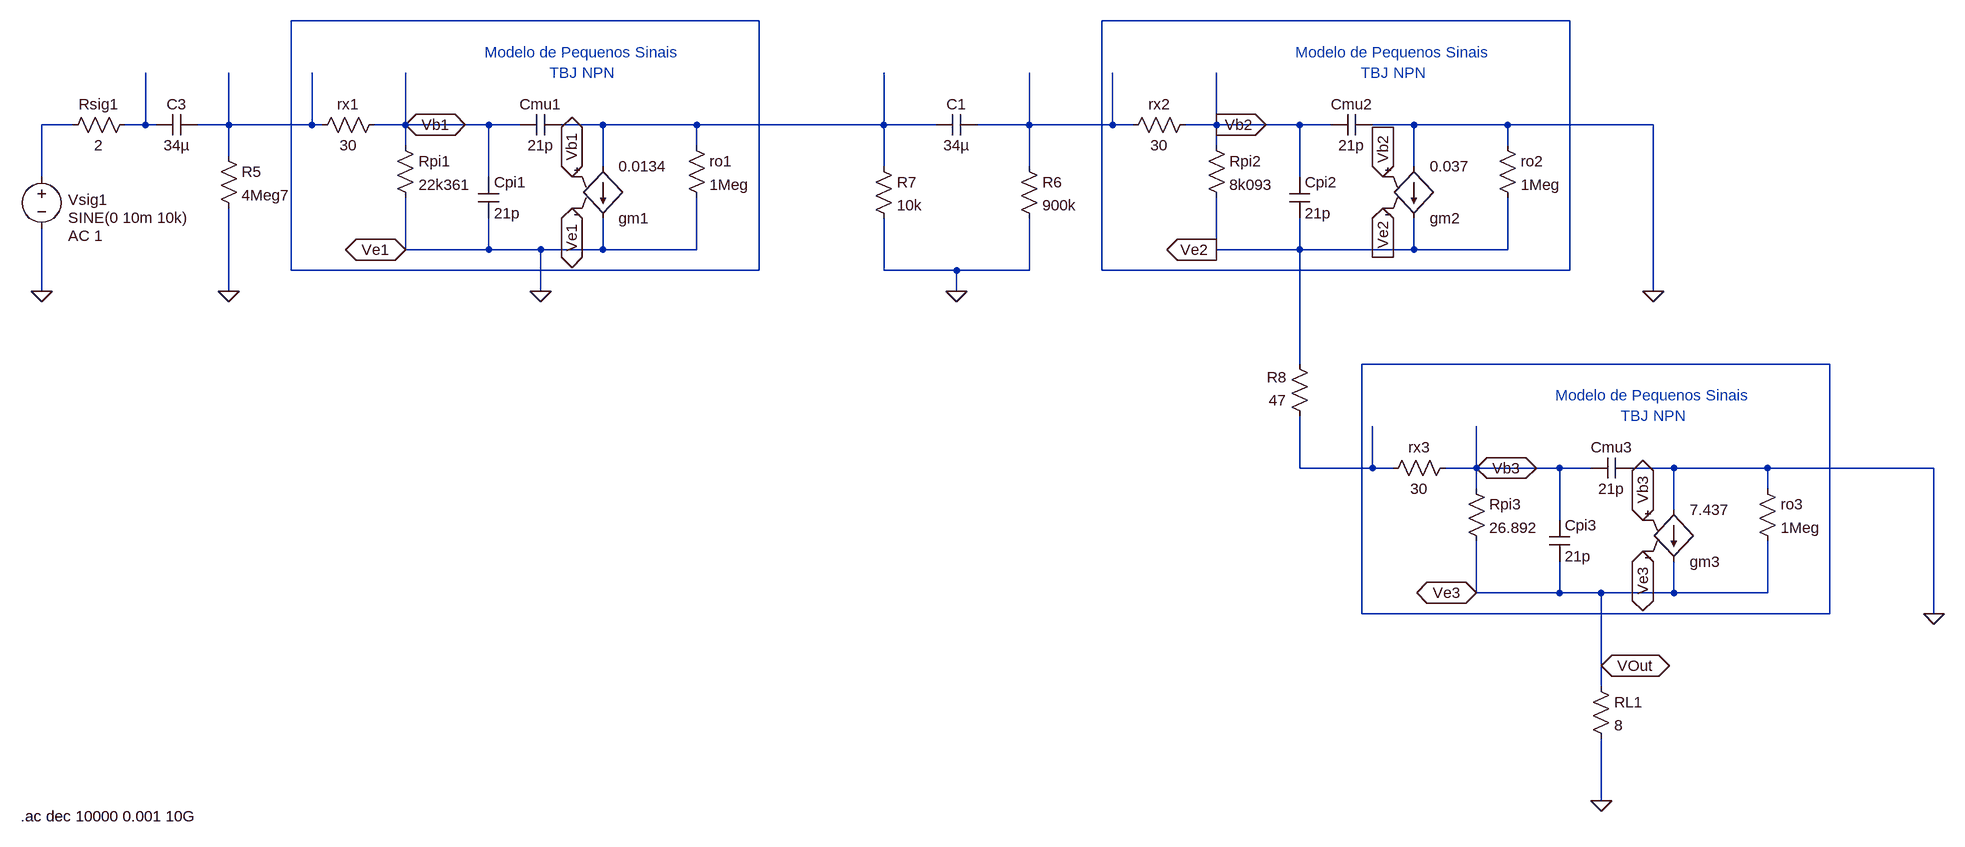
[diagram p0: schematic TBJ - Radio - AM - mod - Resposta em Frequencia.asc]
TBJ - Radio - AM - mod - Resposta em Frequencia.asc, the LTspice schematic file:
Version 4
SHEET 1 3324 2452
WIRE -96 800 -816 800
WIRE 1152 800 432 800
WIRE -1152 960 -1200 960
WIRE -1040 960 -1040 880
WIRE -1040 960 -1072 960
WIRE -1024 960 -1040 960
WIRE -912 960 -912 880
WIRE -912 960 -960 960
WIRE -784 960 -784 880
WIRE -784 960 -912 960
WIRE -768 960 -784 960
WIRE -640 960 -640 880
WIRE -640 960 -688 960
WIRE -512 960 -640 960
WIRE -464 960 -512 960
WIRE -336 960 -400 960
WIRE -192 960 -336 960
WIRE 96 960 96 880
WIRE 96 960 -192 960
WIRE 176 960 96 960
WIRE 320 960 320 880
WIRE 320 960 240 960
WIRE 448 960 448 880
WIRE 448 960 320 960
WIRE 480 960 448 960
WIRE 608 960 608 880
WIRE 608 960 560 960
WIRE 736 960 608 960
WIRE 784 960 736 960
WIRE 912 960 848 960
WIRE 1056 960 912 960
WIRE 1280 960 1056 960
WIRE -640 992 -640 960
WIRE -192 992 -192 960
WIRE 608 992 608 960
WIRE 1056 992 1056 960
WIRE -912 1008 -912 960
WIRE -336 1024 -336 960
WIRE 96 1024 96 960
WIRE 320 1024 320 960
WIRE 912 1024 912 960
WIRE -1200 1040 -1200 960
WIRE -512 1040 -512 960
WIRE 736 1040 736 960
WIRE -640 1152 -640 1072
WIRE -512 1152 -512 1104
WIRE -512 1152 -640 1152
WIRE -432 1152 -512 1152
WIRE -336 1152 -336 1104
WIRE -336 1152 -432 1152
WIRE -192 1152 -192 1072
WIRE -192 1152 -336 1152
WIRE 608 1152 608 1072
WIRE 736 1152 736 1104
WIRE 736 1152 608 1152
WIRE 912 1152 912 1104
WIRE 912 1152 736 1152
WIRE 1056 1152 1056 1072
WIRE 1056 1152 912 1152
WIRE -816 1184 -816 800
WIRE -96 1184 -96 800
WIRE -96 1184 -816 1184
WIRE 96 1184 96 1104
WIRE 208 1184 96 1184
WIRE 320 1184 320 1104
WIRE 320 1184 208 1184
WIRE 432 1184 432 800
WIRE 1152 1184 1152 800
WIRE 1152 1184 432 1184
WIRE -1200 1216 -1200 1120
WIRE -912 1216 -912 1088
WIRE -432 1216 -432 1152
WIRE 208 1216 208 1184
WIRE 1280 1216 1280 960
WIRE 736 1328 736 1152
WIRE 1552 1328 832 1328
WIRE 736 1488 736 1408
WIRE 848 1488 848 1424
WIRE 848 1488 736 1488
WIRE 880 1488 848 1488
WIRE 1008 1488 1008 1424
WIRE 1008 1488 960 1488
WIRE 1136 1488 1008 1488
WIRE 1184 1488 1136 1488
WIRE 1312 1488 1248 1488
WIRE 1456 1488 1312 1488
WIRE 1712 1488 1456 1488
WIRE 1008 1520 1008 1488
WIRE 1456 1520 1456 1488
WIRE 1312 1552 1312 1488
WIRE 1136 1568 1136 1488
WIRE 1008 1680 1008 1600
WIRE 1136 1680 1136 1632
WIRE 1136 1680 1008 1680
WIRE 1200 1680 1136 1680
WIRE 1312 1680 1312 1632
WIRE 1312 1680 1200 1680
WIRE 1456 1680 1456 1600
WIRE 1456 1680 1312 1680
WIRE 832 1712 832 1328
WIRE 1552 1712 1552 1328
WIRE 1552 1712 832 1712
WIRE 1712 1712 1712 1488
WIRE 1200 1792 1200 1680
WIRE 1200 1824 1200 1792
WIRE 1200 2000 1200 1904
FLAG -384 1040 Vb1
IOPIN -384 1040 BiDir
FLAG -384 1088 Ve1
IOPIN -384 1088 BiDir
FLAG -640 960 Vb1
IOPIN -640 960 BiDir
FLAG -640 1152 Ve1
IOPIN -640 1152 BiDir
FLAG -1200 1216 0
FLAG -912 1216 0
FLAG -432 1216 0
FLAG 208 1216 0
FLAG 864 1040 Vb2
IOPIN 864 1040 In
FLAG 864 1088 Ve2
IOPIN 864 1088 In
FLAG 608 960 Vb2
IOPIN 608 960 Out
FLAG 608 1152 Ve2
IOPIN 608 1152 Out
FLAG 1280 1216 0
FLAG 1264 1568 Vb3
IOPIN 1264 1568 BiDir
FLAG 1264 1616 Ve3
IOPIN 1264 1616 BiDir
FLAG 1008 1488 Vb3
IOPIN 1008 1488 BiDir
FLAG 1008 1680 Ve3
IOPIN 1008 1680 BiDir
FLAG 1712 1712 0
FLAG 1200 2000 0
FLAG 1200 1792 VOut
IOPIN 1200 1792 BiDir
SYMBOL res -208 976 R0
SYMATTR InstName ro1
SYMATTR Value 1Meg
SYMBOL res -656 976 R0
SYMATTR InstName Rpi1
SYMATTR Value 22k361
SYMBOL g2 -336 1120 M180
SYMATTR InstName gm1
SYMATTR Value 0.0134
SYMBOL cap -400 944 R90
WINDOW 0 0 32 VBottom 2
WINDOW 3 32 32 VTop 2
SYMATTR InstName Cmu1
SYMATTR Value 21p
SYMBOL cap -528 1040 R0
SYMATTR InstName Cpi1
SYMATTR Value 21p
SYMBOL res -672 944 R90
WINDOW 0 0 56 VBottom 2
WINDOW 3 32 56 VTop 2
SYMATTR InstName rx1
SYMATTR Value 30
SYMBOL res -928 992 R0
SYMATTR InstName R5
SYMATTR Value 4Meg7
SYMBOL cap -960 944 R90
WINDOW 0 0 32 VBottom 2
WINDOW 3 32 32 VTop 2
SYMATTR InstName C3
SYMATTR Value 34µ
SYMBOL voltage -1200 1024 R0
WINDOW 123 41 107 Left 2
WINDOW 39 0 0 Left 0
WINDOW 0 41 51 Left 2
WINDOW 3 41 79 Left 2
SYMATTR Value2 AC 1
SYMATTR InstName Vsig1
SYMATTR Value SINE(0 10m 10k)
SYMBOL res -1056 944 R90
WINDOW 0 0 56 VBottom 2
WINDOW 3 32 56 VTop 2
SYMATTR InstName Rsig1
SYMATTR Value 2
SYMBOL res 304 1008 R0
SYMATTR InstName R6
SYMATTR Value 900k
SYMBOL res 80 1008 R0
SYMATTR InstName R7
SYMATTR Value 10k
SYMBOL cap 240 944 R90
WINDOW 0 0 32 VBottom 2
WINDOW 3 32 32 VTop 2
SYMATTR InstName C1
SYMATTR Value 34µ
SYMBOL res 1040 976 R0
SYMATTR InstName ro2
SYMATTR Value 1Meg
SYMBOL res 592 976 R0
SYMATTR InstName Rpi2
SYMATTR Value 8k093
SYMBOL g2 912 1120 M180
SYMATTR InstName gm2
SYMATTR Value 0.037
SYMBOL cap 848 944 R90
WINDOW 0 0 32 VBottom 2
WINDOW 3 32 32 VTop 2
SYMATTR InstName Cmu2
SYMATTR Value 21p
SYMBOL cap 720 1040 R0
SYMATTR InstName Cpi2
SYMATTR Value 21p
SYMBOL res 576 944 R90
WINDOW 0 0 56 VBottom 2
WINDOW 3 32 56 VTop 2
SYMATTR InstName rx2
SYMATTR Value 30
SYMBOL res 1440 1504 R0
SYMATTR InstName ro3
SYMATTR Value 1Meg
SYMBOL res 992 1504 R0
SYMATTR InstName Rpi3
SYMATTR Value 26.892
SYMBOL g2 1312 1648 M180
SYMATTR InstName gm3
SYMATTR Value 7.437
SYMBOL cap 1248 1472 R90
WINDOW 0 0 32 VBottom 2
WINDOW 3 32 32 VTop 2
SYMATTR InstName Cmu3
SYMATTR Value 21p
SYMBOL cap 1120 1568 R0
SYMATTR InstName Cpi3
SYMATTR Value 21p
SYMBOL res 976 1472 R90
WINDOW 0 0 56 VBottom 2
WINDOW 3 32 56 VTop 2
SYMATTR InstName rx3
SYMATTR Value 30
SYMBOL res 752 1424 R180
WINDOW 0 36 76 Left 2
WINDOW 3 36 40 Left 2
SYMATTR InstName R8
SYMATTR Value 47
SYMBOL res 1184 1808 R0
SYMATTR InstName RL1
SYMATTR Value 8
TEXT -368 864 Center 2 ;Modelo de Pequenos Sinais\nTBJ NPN
TEXT 880 864 Center 2 ;Modelo de Pequenos Sinais\nTBJ NPN
TEXT 1280 1392 Center 2 ;Modelo de Pequenos Sinais\nTBJ NPN
TEXT -1232 2024 Left 2 !.ac dec 10000 0.001 10G

The netlist it stands for:
* TBJ - Radio - AM - mod - Resposta em Frequencia.asc
ro1 N006 0 1Meg
Rpi1 Vb1 0 22k361
gm1 N006 0 Vb1 0 0.0134
Cmu1 N006 Vb1 21p
Cpi1 Vb1 0 21p
rx1 Vb1 N005 30
R5 N005 0 4Meg7
C3 N005 N004 34µ
Vsig1 N003 0 SINE(0 10m 10k) AC 1
Rsig1 N004 N003 2
R6 N007 0 900k
R7 N006 0 10k
C1 N007 N006 34µ
ro2 0 Ve2 1Meg
Rpi2 Vb2 Ve2 8k093
gm2 0 Ve2 Vb2 Ve2 0.037
Cmu2 0 Vb2 21p
Cpi2 Vb2 Ve2 21p
rx2 Vb2 N007 30
ro3 0 VOut 1Meg
Rpi3 Vb3 VOut 26.892
gm3 0 VOut Vb3 VOut 7.437
Cmu3 0 Vb3 21p
Cpi3 Vb3 VOut 21p
rx3 Vb3 N009 30
R8 N009 Ve2 47
RL1 VOut 0 8
* Modelo de Pequenos Sinais
* TBJ NPN
* Modelo de Pequenos Sinais
* TBJ NPN
* Modelo de Pequenos Sinais
* TBJ NPN
.ac dec 10000 0.001 10G
.backanno
.end